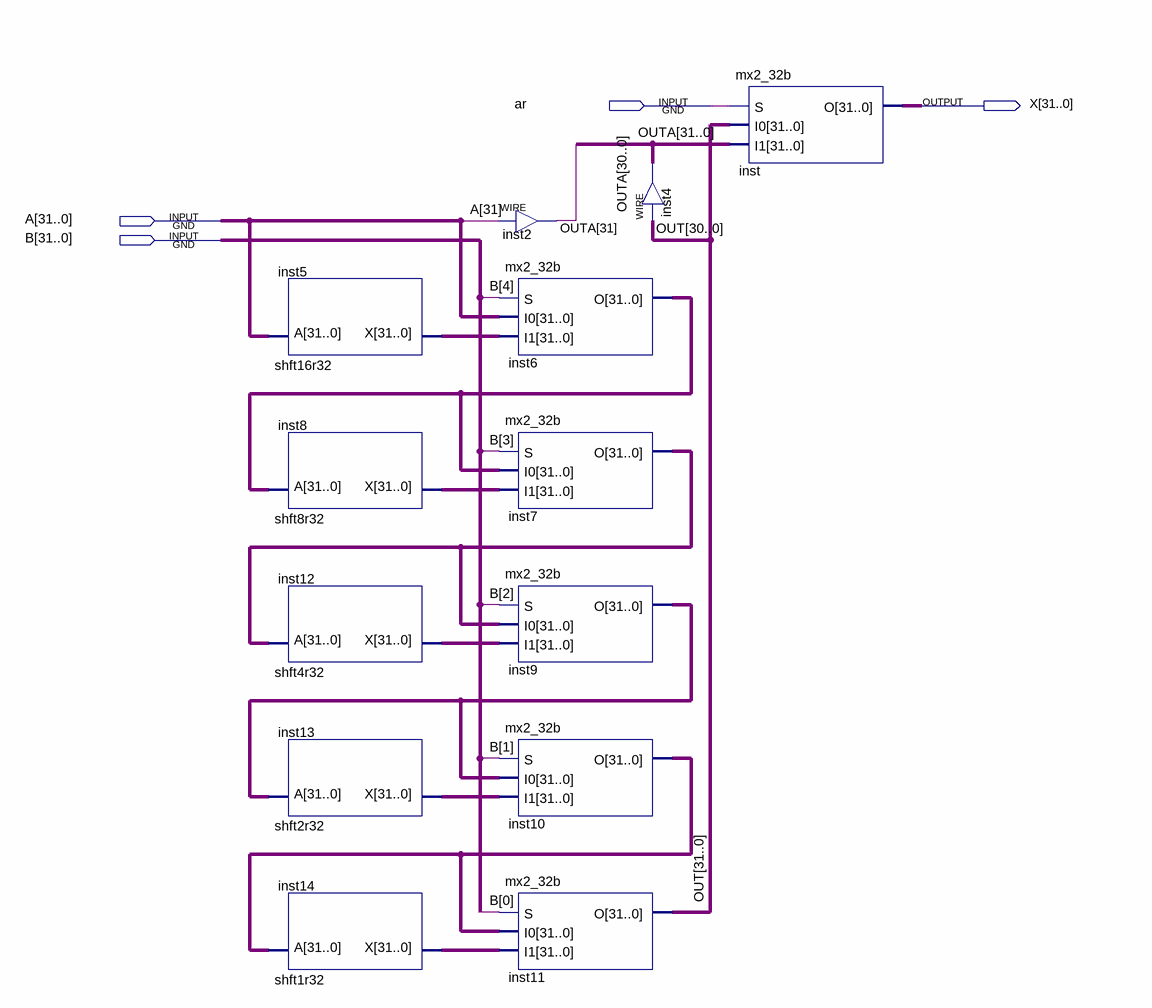
[diagram p0: schematic sheet]
// Quartus schematic shftr32.bdf as structural Verilog: 13 symbols, 4 pins
module shftr32 (
  input  ar,
  input  [31:0] A,
  input  [31:0] B,
  output [31:0] X
);

  wire [31:0] inst5_x, inst6_o, inst7_o, inst8_x, inst9_o, inst10_o, inst12_x, inst13_x, inst14_x, OUT, OUTA;

  shft16r32 inst5 (.A(A), .X(inst5_x));
  shft8r32 inst8 (.A(inst6_o), .X(inst8_x));
  shft4r32 inst12 (.A(inst7_o), .X(inst12_x));
  shft2r32 inst13 (.A(inst9_o), .X(inst13_x));
  shft1r32 inst14 (.A(inst10_o), .X(inst14_x));
  assign OUTA[31] = A[31];  // WIRE inst2
  mx2_32b inst6 (.S(B[4]), .I0(A), .I1(inst5_x), .O(inst6_o));
  mx2_32b inst7 (.S(B[3]), .I0(inst6_o), .I1(inst8_x), .O(inst7_o));
  mx2_32b inst9 (.S(B[2]), .I0(inst7_o), .I1(inst12_x), .O(inst9_o));
  mx2_32b inst10 (.S(B[1]), .I0(inst9_o), .I1(inst13_x), .O(inst10_o));
  mx2_32b inst11 (.S(B[0]), .I0(inst10_o), .I1(inst14_x), .O(OUT));
  assign OUTA[30:0] = OUT[30:0];  // WIRE inst4
  mx2_32b inst (.S(ar), .I0(OUT), .I1(OUTA), .O(X));
endmodule
